# Altium schematic sheet eth.SchDoc
size A
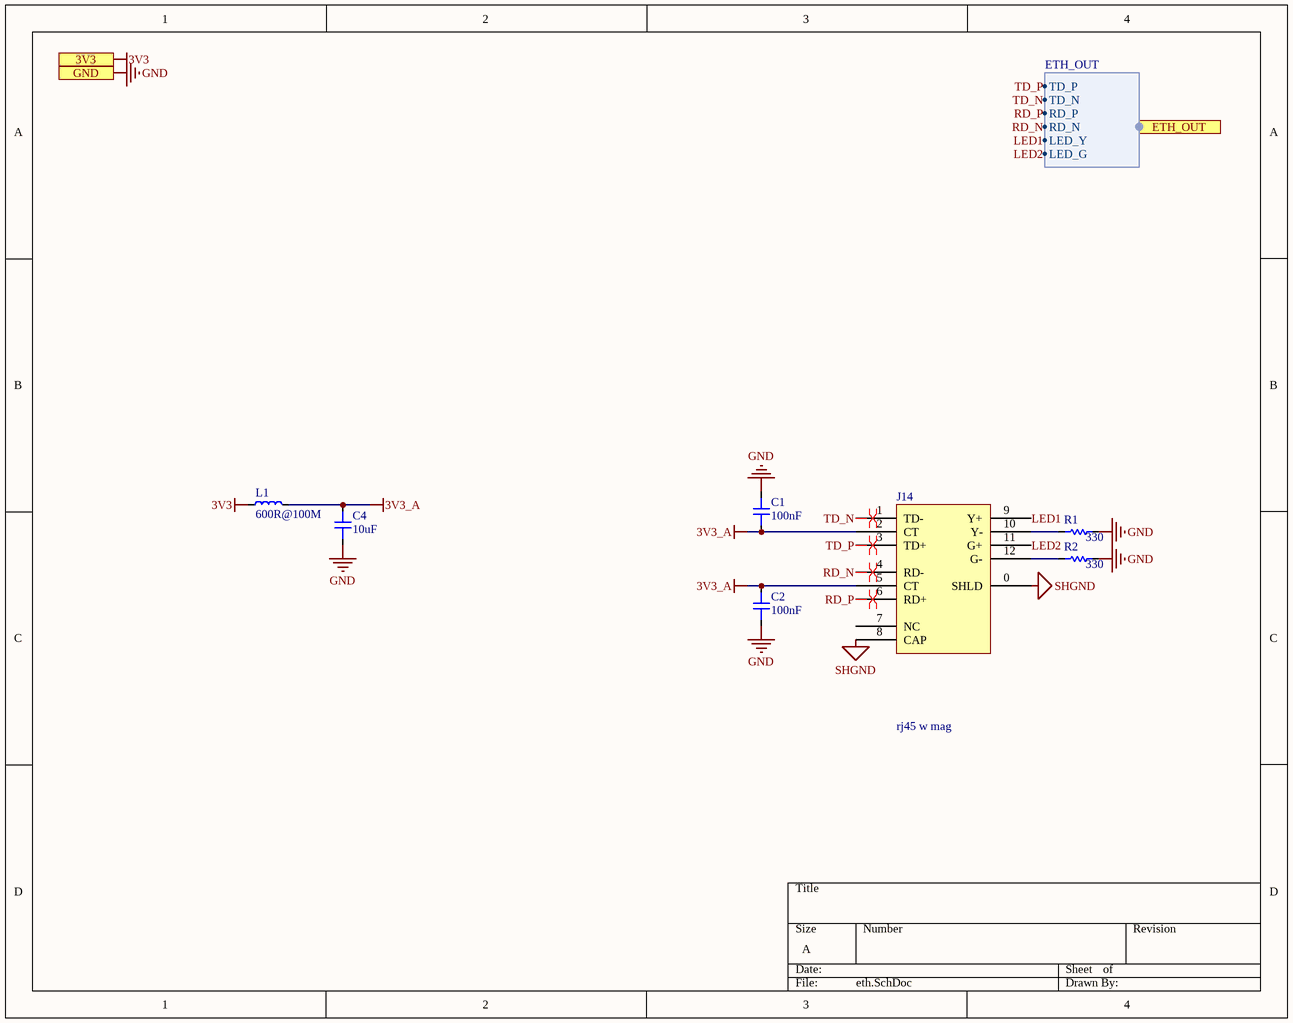
[diagram p0: eth.SchDoc]

## Parts
C1  100nF  [CAP 0805 L]
C2  100nF  [CAP 0805 L]
C4  10uF  [CAP 0805 L]
J14  rj45 w mag  [CONN RJ45 MAG VERT]
L1  600R@100M  [IND 0805 L]
R1  330  [RES 0603 L]
R2  330  [RES 0603 L]

## Ports
3V3, ETH_OUT (harness ETH_OUT), GND

## Harnesses
ETH_OUT: TD_P, TD_N, RD_P, RD_N, LED_Y, LED_G

## Nets
3V3: L1.1 ; port 3V3
3V3_A: C1.1 C2.2 C4.2 J14.2(CT) J14.5(CT) L1.2
GND: C1.2 C2.1 C4.1 R1.2 R2.2 ; port GND
SHGND: J14.0(SHLD) J14.8(CAP)
LED1: J14.9(Y+) ; port ETH_OUT.LED_Y
LED2: J14.11(G+) ; port ETH_OUT.LED_G
RD_N: J14.4(RD-) ; port ETH_OUT.RD_N
RD_P: J14.6(RD+) ; port ETH_OUT.RD_P
TD_N: J14.1(TD-) ; port ETH_OUT.TD_N
TD_P: J14.3(TD+) ; port ETH_OUT.TD_P
NetJ14_10: J14.10(Y-) R1.1
NetJ14_12: J14.12(G-) R2.1

Not connected (* = marked no-connect by the designer): J14 7(NC)

## Layout directives
differential pair: RD_N, RD_P, TD_N, TD_P

## Library data of the parts
C1 C2 C4 = CAP 0805
J14 = CONN rj45 mag vert: Conn RJ-45 RCP 8 POS 2.54mm Solder ST Thru-Hole 12 Terminal 1 Port Tray; Manufacturer 1: Pulse; Manufacturer Part Number 1: JD2-0010NL; Direction: User Selectable; Number of Cores per Jack: 4; Number of Ports: 1; Shielding: Shielded; RoHS: Yes; Category: Modular / Ethernet Connectors; Stock 1: 5585; Pricing 1: 1=4.53000, 10=4.34400, 25=3.98200, 50=3.80100, 100=3.62000, 250=3.16752, 500=3.07700, 1000=2.62450, 2500=2.44350 (USD); Mount: Through Hole; Contact Plating: Gold; Housing Material: Thermoplastic; Color: Green,Yellow; Contact Material: Copper Alloy; Min Operating Temperature: 0°C; Max Operating Temperature: 70°C; Orientation: Vertical; Packaging: Tray; Connector Type: RJ45; Number of Rows: 1; Termination: Solder; ComponentLink1URL: http://www.farnell.com/datasheets/2699974.pdf?src-supplier=Farnell; ComponentLink1Description: http://www.farnell.com/datasheets/2699974.pdf?src-supplier=Farnell; ComponentLink2URL: http://productfinder.pulseeng.com/products/datasheets/JD2-0010NL.pdf?src-supplier=Avnet; ComponentLink2Description: http://productfinder.pulseeng.com/products/datasheets/JD2-0010NL.pdf?src-supplier=Avnet; ComponentLink3URL: https://productfinder.pulseeng.com/doc_type/WEB301/doc_num/JD2-0010NL-01/doc_part/JD2-0010NL.pdf?src-supplier=Digi-Key; ComponentLink3Description: https://productfinder.pulseeng.com/doc_type/WEB301/doc_num/JD2-0010NL-01/doc_part/JD2-0010NL.pdf?src-supplier=Digi-Key; Supplier 1: Digi-Key; Supplier Part Number 1: 553-2608-ND
L1 = IND 0805
R1 R2 = RES 0603